# Altium schematic sheet supply1.SchDoc: foxBMS BMS-Master
size A3; DocumentNumber: 3; SheetNumber: 3; SheetTotal: 24; Author: Fraunhofer IISB foxBMS Team; REL-DATE: 2017-05-16; VERSION: 1.0.2; SheetDescription: Supply for MCU1 and peripherals
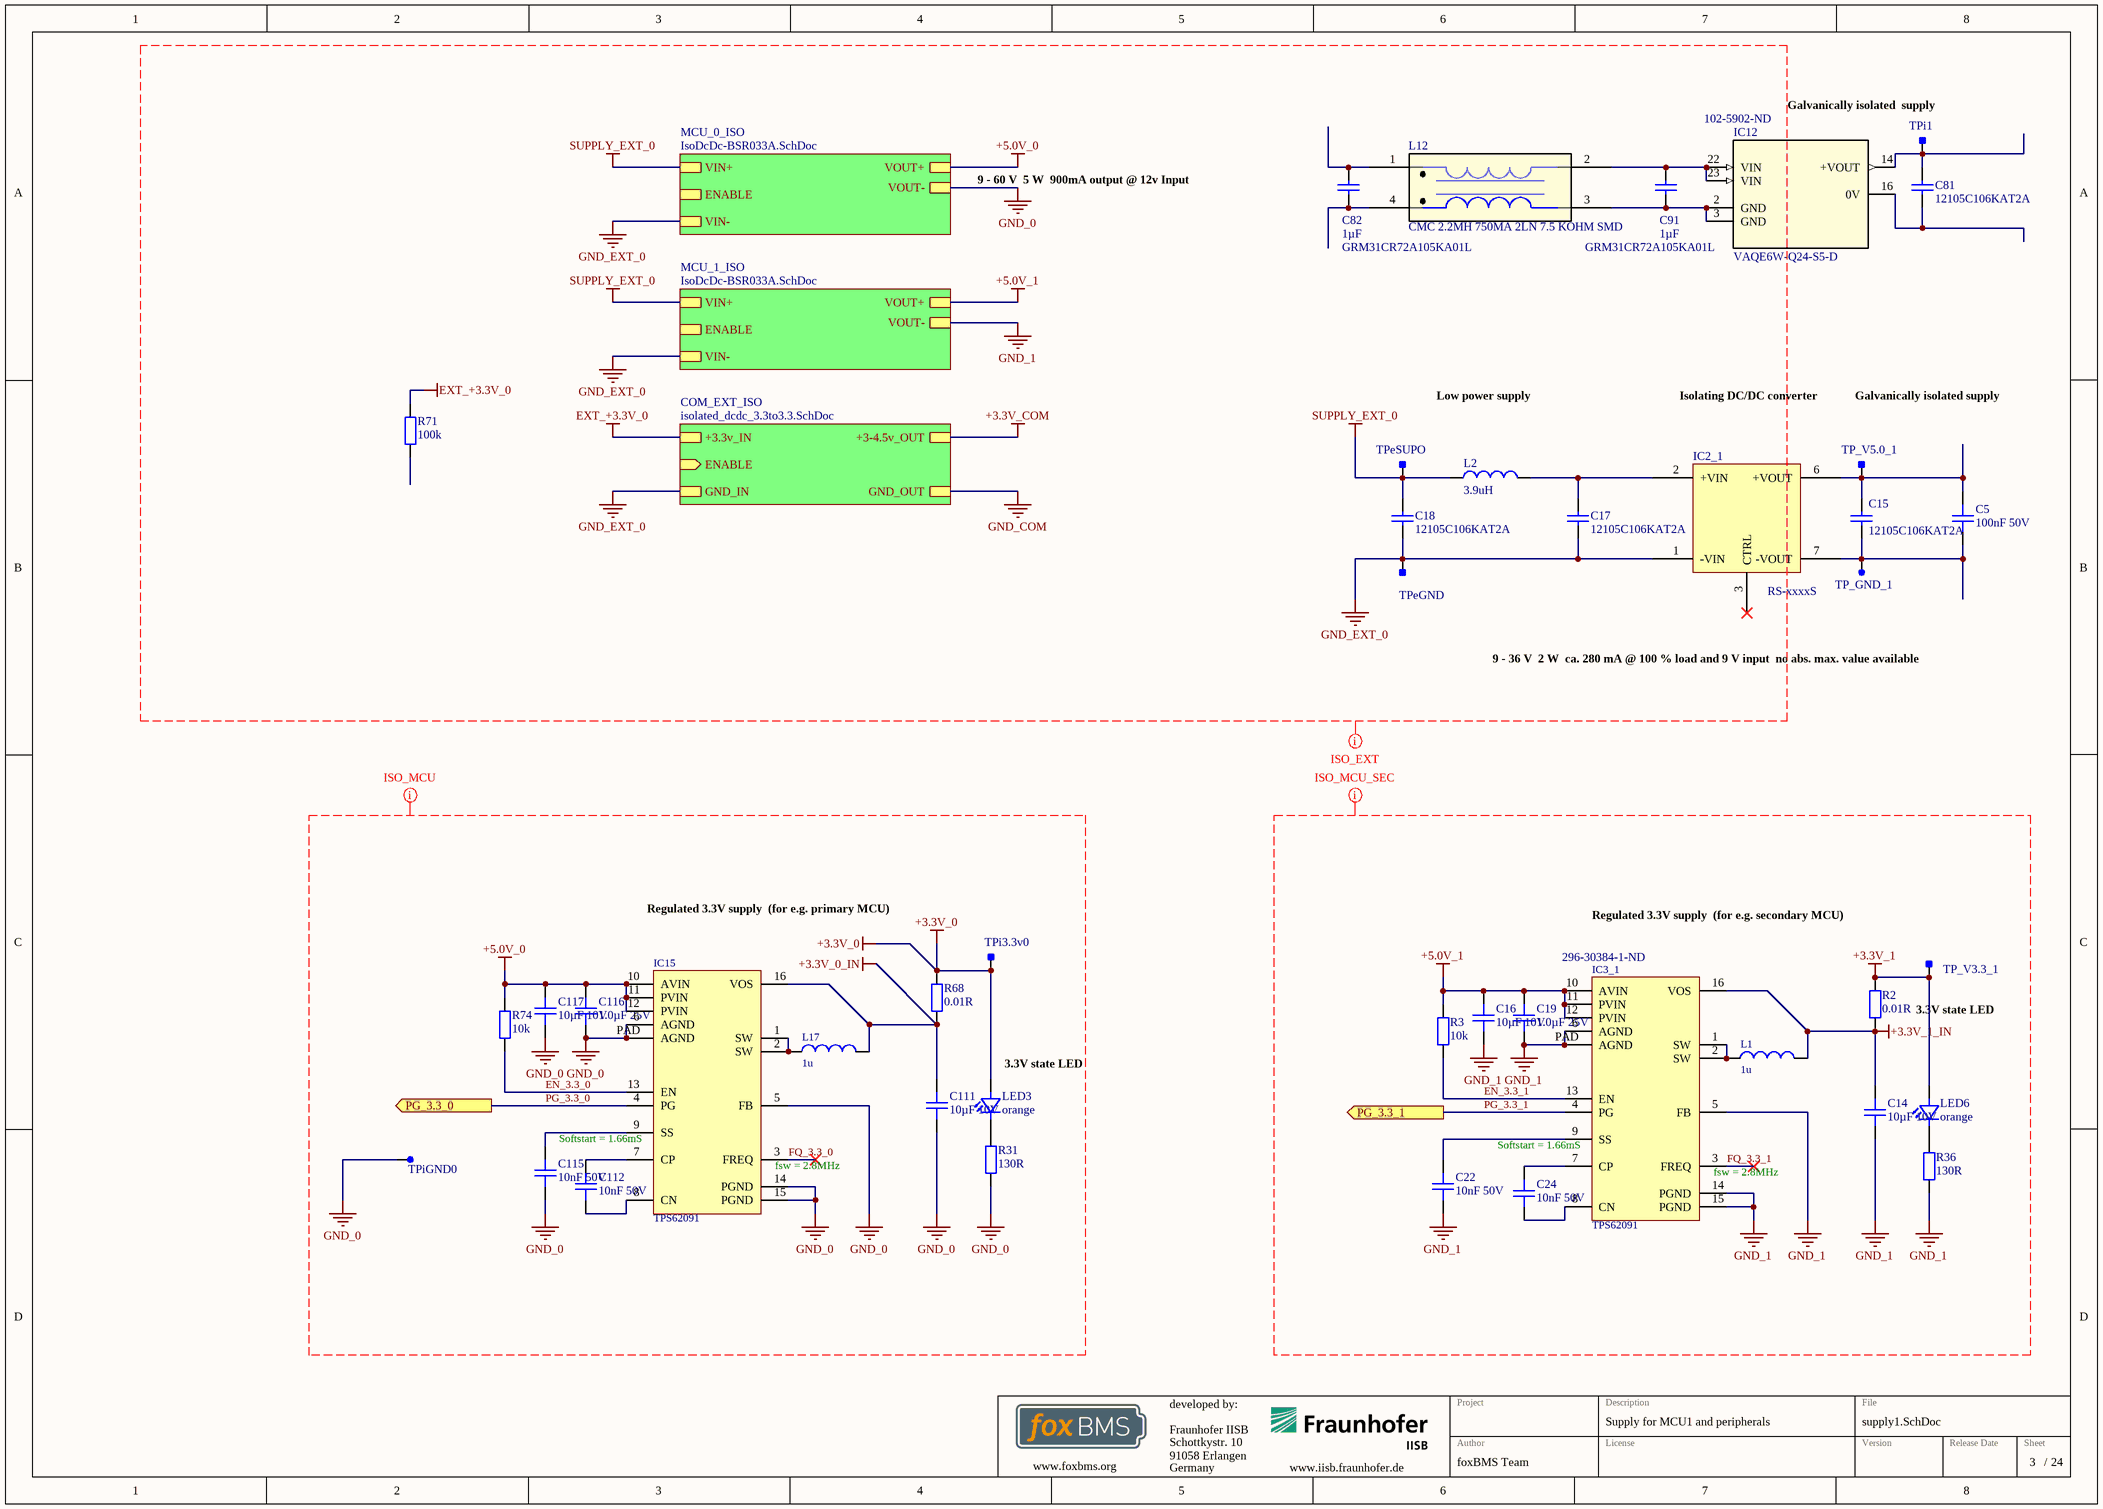
[diagram p0: supply1.SchDoc]

## Parts
C5  100nF 50V  [0603C]
C14  10µF 10V  [0805C]
C15  12105C106KAT2A  [CAPC3225X279X50LL20T25]
C16  10µF 10V  [0805C]
C17  12105C106KAT2A  [CAPC3225X279X50LL20T25]
C18  12105C106KAT2A  [CAPC3225X279X50LL20T25]
C19  1.0µF 25V  [0603C]
C22  10nF 50V  [0603C]
C24  10nF 50V  [0603C]
C81  12105C106KAT2A  [CAPC3225X279X50LL20T25]
C82  GRM31CR72A105KA01L  Capacitance: 1µF  [CAPC3216X180X55ML20T25]
C91  GRM31CR72A105KA01L  Capacitance: 1µF  [CAPC3216X180X55ML20T25]
C111  10µF 10V  [0805C]
C112  10nF 50V  [0603C]
C115  10nF 50V  [0603C]
C116  1.0µF 25V  [0603C]
C117  10µF 10V  [0805C]
IC2_1  RS-xxxxS  [RECOM_RS-S_D]
IC3_1  TPS62091  Supplier Part Number 1: 296-30384-1-ND  [QFN-16-TI]
IC12  VAQE6W-Q24-S5-D  Supplier Part Number 1: 102-5902-ND  [VAQE6W-Q24-S5-D]
IC15  TPS62091  [QFN-16-TI]
L1  1u  [WE-LQS]
L2  value 3.9uH  [INDC4532]  (hidden comment: FIXED IND 3.9UH 1.32A 140MOHM SM)
L12  CMC 2.2MH 750MA 2LN 7.5 KOHM SMD  [WE-SL5]
L17  1u  [WE-LQS]
LED3  orange  [LEDC1608X07N]
LED6  orange  [LEDC1608X07N]
R2  0.01R  [0805R]
R3  10k  [0603R]
R31  130R  [0603R]
R36  130R  [0603R]
R68  0.01R  [0805R]
R71  100k  [0603R]
R74  10k  [0603R]
TP_GND_1  Testpoint_Round  [Testpoint_D1V]  (value not drawn)  (no BOM)
TP_V3.3_1  Testpoint_Square  [Testpoint_S1]  (value not drawn)  (no BOM)
TP_V5.0_1  Testpoint_Square  [Testpoint_S1]  (value not drawn)  (no BOM)
TPeGND  Testpoint_Square  [Testpoint_S1]  (value not drawn)  (no BOM)
TPeSUPO  Testpoint_Square  [Testpoint_S1]  (value not drawn)  (no BOM)
TPi1  Testpoint_Square  [Testpoint_S1]  (value not drawn)  (no BOM)
TPi3.3v0  Testpoint_Square  [Testpoint_S1]  (value not drawn)  (no BOM)
TPiGND0  Testpoint_Round  [Testpoint_D1V]  (value not drawn)  (no BOM)

## Sub-sheets
COM_EXT_ISO = isolated_dcdc_3.3to3.3.SchDoc: ENABLE (in), +3.3v_IN, GND_OUT, +3-4.5v_OUT, GND_IN
MCU_0_ISO = IsoDcDc-BSR033A.SchDoc: ENABLE, VIN+, VOUT+, VOUT-, VIN-
MCU_1_ISO = IsoDcDc-BSR033A.SchDoc: ENABLE, VIN+, VOUT+, VOUT-, VIN-

## Ports
PG_3.3_0 (out), PG_3.3_1 (out)

## Nets
+3.3V_0: LED3.2(A) R68.1 TPi3.3v0.1
+3.3V_0_IN: C111.1 IC15.16(VOS) L17.2 R68.2
+3.3V_1: LED6.2(A) R2.1 TP_V3.3_1.1
+3.3V_1_IN: C14.1 IC3_1.16(VOS) L1.2 R2.2
+3.3V_COM: sheet COM_EXT_ISO/+3-4.5v_OUT
+5.0V_0: C116.1 C117.1 IC15.10(AVIN) IC15.11(PVIN) IC15.12(PVIN) R74.2 ; sheet MCU_0_ISO/VOUT+
+5.0V_1: C16.1 C19.1 IC3_1.10(AVIN) IC3_1.11(PVIN) IC3_1.12(PVIN) R3.2 ; sheet MCU_1_ISO/VOUT+
EXT_+3.3V_0: R71.2 ; sheet COM_EXT_ISO/+3.3v_IN
GND_0: C111.2 C115.2 C116.2 C117.2 IC15.5(FB) IC15.6(AGND) IC15.14(PGND) IC15.15(PGND) IC15.PAD(AGND) R31.1 TPiGND0.1 ; sheet MCU_0_ISO/VOUT-
GND_1: C14.2 C16.2 C19.2 C22.2 IC3_1.5(FB) IC3_1.6(AGND) IC3_1.14(PGND) IC3_1.15(PGND) IC3_1.PAD(AGND) R36.2 ; sheet MCU_1_ISO/VOUT-
GND_COM: sheet COM_EXT_ISO/GND_OUT
GND_EXT_0: C17.1 C18.1 IC2_1.1(-VIN) TPeGND.1 ; sheet MCU_0_ISO/VIN-, sheet MCU_1_ISO/VIN-, sheet COM_EXT_ISO/GND_IN
SUPPLY_EXT_0: C18.2 L2.1 TPeSUPO.1 ; sheet MCU_0_ISO/VIN+, sheet MCU_1_ISO/VIN+
EN_3.3_0: IC15.13(EN) R74.1
EN_3.3_1: IC3_1.13(EN) R3.1
FQ_3.3_0: IC15.3(FREQ)
FQ_3.3_1: IC3_1.3(FREQ)
PG_3.3_0: IC15.4(PG) ; port PG_3.3_0
PG_3.3_1: IC3_1.4(PG) ; port PG_3.3_1
NetC5_1: C5.1 C15.2 IC2_1.6(+VOUT) TP_V5.0_1.1
NetC5_2: C5.2 C15.1 IC2_1.7(-VOUT) TP_GND_1.1
NetC17_2: C17.2 IC2_1.2(+VIN) L2.2
NetC22_1: C22.1 IC3_1.9(SS)
NetC24_1: C24.1 IC3_1.7(CP)
NetC24_2: C24.2 IC3_1.8(CN)
NetC81_1: C81.1 IC12.16(0V)
NetC81_2: C81.2 IC12.14(+VOUT) TPi1.1
NetC82_1: C82.1 L12.4
NetC82_2: C82.2 L12.1
NetC91_1: C91.1 IC12.2(GND) IC12.3(GND) L12.3
NetC91_2: C91.2 IC12.22(VIN) IC12.23(VIN) L12.2
NetC112_1: C112.1 IC15.7(CP)
NetC112_2: C112.2 IC15.8(CN)
NetC115_1: C115.1 IC15.9(SS)
NetIC3_1_1: IC3_1.1(SW) IC3_1.2(SW) L1.1
NetIC15_1: IC15.1(SW) IC15.2(SW) L17.1
NetLED3_1: LED3.1(C) R31.2
NetLED6_1: LED6.1(C) R36.1

Not connected (* = marked no-connect by the designer): IC2_1 3(CTRL)*; R71 1

## Layout directives
net class ISO_MCU_SEC: +3.3V_1, +3.3V_1_IN, +5.0V_1, EN_3.3_1, FQ_3.3_1, GND_1, PG_3.3_1
net class ISO_EXT: +3.3V_COM, +5.0V_0, +5.0V_1, EXT_+3.3V_0, GND_0, GND_1, GND_COM, GND_EXT_0, SUPPLY_EXT_0
net class ISO_MCU: +3.3V_0, +3.3V_0_IN, +5.0V_0, EN_3.3_0, FQ_3.3_0, GND_0, PG_3.3_0

## Notes on the sheet
- (near TPi1) Galvanically isolated
  supply
- 9 - 60 V
  5 W
  900mA output @ 12v Input
- Low power supply
- Isolating DC/DC converter
- Galvanically isolated supply
- 9 - 36 V
  2 W
  ca. 280 mA @ 100 % load and 9 V input
  no abs. max. value available
- Regulated 3.3V supply
  (for e.g. primary MCU)
- Regulated 3.3V supply
  (for e.g. secondary MCU)
- 3.3V state LED
- (near LED3) 3.3V state LED
- (near IC15) Softstart = 1.66mS
- (near IC15) fsw = 2.8MHz
- (near IC3_1) Softstart = 1.66mS
- (near IC3_1) fsw = 2.8MHz
- Fraunhofer IISB
- Schottkystr. 10
- developed by:
- 91058 Erlangen
- Germany
- Author
- Project
- License
- Description
- File
- Version
- Release Date
- Sheet
- www.foxbms.org
- www.iisb.fraunhofer.de
- foxBMS Team
- /

## Library data of the parts
C5 = gen_C_ceramic_100n_50V_X7R_0603: Ceramic, 100nF, ±10%, 50V, X7R, –55 to 125°C, 0603 (1608),RoHS, Automotive; Part Number: GCJ188R71H104KA12; Manufacturer: Murata; Capacitance: 100n; Case EIA: 0603; Case Metric: 1608; PnP Package: C_0603_10; PnP Value: 100nF/50V/X7R; PnP equipped: x; Automotive Qualified: True; Rated Voltage: 50V; Dielectric: X7R; Supplier 1: Digi-Key; Supplier Part Number 1: 490-5798-1-ND; Height - Seated (Max): 0.8mm; Mounting Type: SurfaceMount,MLCC; Operating Temperature: –55 to 125°C; Series: GCJ; Tolerance: ±10%; Manufacturer_Part_Number: GCJ188R71H104KA12
C14 C16 C111 C117 = gen_C_ceramic_10u_10V_X7R_0805: Ceramic, 10µF, ±10%, 10V, X7R, –55 to 125°C, 0805 (2012),RoHS, Automotive; Part Number: GCJ21BR71A106KE01; Manufacturer: Murata; Case EIA: 0805; Case Metric: 2012; Automotive Qualified: True; PnP Package: C_0805_10; PnP Value: 10µF/10V/X7R; Dielectric: X7R; Capacitance: 10µF; Height - Seated (Max): 1.25mm; Mounting Type: SurfaceMount,MLCC; Operating Temperature: –55 to 125°C; Rated Voltage: 10V; Series: GCJ; Tolerance: ±10%; Manufacturer_Part_Number: GCJ21BR71A106KE01; Supplier 1: Digi-Key; Supplier Part Number 1: 490-12646-1-ND
C15 C17 C18 C81 = gen_C_ceramic_10u_25V_X7R_1210: Multilayer Ceramic Capacitor, 50 V, -55 to 125 degC, 2-Pin SMD (1210), RoHS, Tape and Reel; Manufacturer: AVX; Dielectric: X7R; Tolerance: 10%; Capacitance: 10uF; Load Life: 1000h; Type: CommercialSurfaceMountChip; Voltage Rating: 50V; Temperature Coefficient / Code: +/-15%; Automotive Qualified: True; Case EIA: 1210; Case Metric: 3225; PnP Package: C_1210_10; PnP Value: 10µF/25V/X7R; Rated Voltage: 25V; Maximum Operating Temperature: +125C; Mounting Technology: SurfaceMount; Case Code - in: 1210; Package Description: 2-Pin Surface Mount Device, Body 3.2 x 2.5 mm; Datasheet URL: http://www.farnell.com/datasheets/1818074.pdf; Case Code - mm: 3225; Package / Case: 1210(3225metric); Product: GeneralTypeMLCCs; Product Category: MultilayerCeramicCapacitorsMLCC-SMD/SMT; Minimum Operating Temperature: -55C; Manufacturer URL: http://www.avx.com/; Operating Temperature Range: -55Cto+125C; Termination Style: SMD/SMT; Factory Pack Quantity: 1000; RoHS: Details; Brand: AVX; Datasheet Version: 03/2014; Package Reference: 1210; Packaging: Reel; Voltage Rating DC: 50V; Operating Temperature: –55 to 125°C
C19 C116 = gen_C_ceramic_1u_25V_X7R_0603: Ceramic, 1.0µF, ±10%, 25V, X7R, –55 to 125°C, 0603 (1608),RoHS, Automotive; Part Number: GCJ188R71E105KA01; Manufacturer: Murata; Case EIA: 0603; Case Metric: 1608; Capacitance: 1µF; Automotive Qualified: True; PnP Package: C_0603_10; PnP Value: 1.0µF/25V/X7R; Dielectric: X7R; Rated Voltage: 25V; Height - Seated (Max): 0.8mm; Mounting Type: SurfaceMount,MLCC; Operating Temperature: –55 to 125°C; Series: GCJ; Tolerance: ±10%; Manufacturer_Part_Number: GCJ188R71E105KA01; Supplier 1: Digi-Key; Supplier Part Number 1: 490-14409-1-ND
C22 C24 C112 C115 = gen_C_ceramic_10n_50V_X7R_0603: Ceramic, 10nF, ±10%, 50V, X7R, –55 to 125°C, 0603 (1608),RoHS, Automotive; Part Number: GCJ188R71H102KA01; Manufacturer: Murata; Case EIA: 0603; Case Metric: 1608; Capacitance: 10n; Automotive Qualified: True; PnP Package: C_0603_10; PnP Value: 10nF/50V/X7R; Dielectric: X7R; Rated Voltage: 50V; Height - Seated (Max): 0.8mm; Mounting Type: SurfaceMount,MLCC; Operating Temperature: –55 to 125°C; Series: GCJ; Tolerance: ±10%; Manufacturer_Part_Number: GCJ188R71H102KA01; Supplier 1: Digi-Key; Supplier Part Number 1: 490-5768-1-ND
C82 C91 = gen_C_ceramic_1u_100V_X7R_1206: Chip Capacitor, 1 uF, +/- 10%, 100 V, -55 to 125 degC, 1206 (3216 Metric), RoHS, Tape and Reel; Manufacturer: Murata; Catalog Drawings: GRMSeries_1206_1.6; Featured Product: GA3SafetyRecognizedCapsandHi-CapMLCC; Online Catalog: GRMSeries; Temperature Coefficient: X7R; Product Training Modules: High-CapMultilayerCeramicCapacitors; Other Names: 490-3909-6; Voltage - Rated: 100V; Case EIA: 1206; PnP Package: C_1206_10; PnP Value: 1.0µF/100V/X7R; Height - Seated (Max): -; Features: -; Applications: GeneralPurpose; Manufacturer URL: http://www.murata.com/; Standard Package: 1; Package Reference: 1206; Series: GRM; Package / Case: 1206(3216Metric); Datasheet Version: Sep-11; Ratings: -; Category: Capacitors; Datasheet URL: https://datasheet.ciiva.com/29199/454987-da-01-en-vs-kondensator-1206-29199435.pdf; Operating Temperature: -55degC~125degC; Lead Spacing: -; Family: CeramicCapacitors; Tolerance: ±10%; Packaging: Digi-Reel; Mounting Type: SurfaceMount,MLCC; Package Description: 2-Pin Surface Mount Device, Body 3.2 x 1.6 mm; Lead Style: -; Thickness (Max): 0.071"(1.80mm); Size / Dimension: 0.126"Lx0.063"W(3.20mmx1.60mm); Dielectric: X7R; Rated Voltage: 100V
IC2_1 = Recom_RS-2405SZ/H3: Isolating DC/DC Converter; Manufacturer: Recom; Automotive Qualified: False; Part Number: Recom_RS-2405SZ/H3; ComponentLink1Description: Datasheet; ComponentLink1URL: https://www.recom-power.com/pdf/Econoline/RS-S_D_Z.pdf; Supplier 1: Digikey; Supplier Part Number 1: 945-1552-5-ND; Supplier 2: Farnell; Supplier Part Number 2: 1893731; Supplier 3: Mouser; Supplier Part Number 3: 919-RS-2405SZ/H3
IC3_1 IC15 = TPS62090: '''TI TPS62091 Integrated Sync. Buck Converter''' / - fsw=1.4/2.8MHz / - Vin = 2.5-6V, Vout=3.3V, Iout=3A / - 3x3mm QFN-16, RoHS compliant; DBDesc: '''TI TPS62091 Integrated Sync. Buck Converter''' / - fsw=1.4/2.8MHz / - Vin = 2.5-6V, Vout=0.8-Vin, Iout=3A / - 3x3mm QFN-16, RoHS compliant; ID: 21555; Part Number: TPS62091; Supplier 1: Digi-Key
  IC15: Supplier Part Number 1: 296-30384-1-ND
IC12 = VAQE6W-Q24-S5-D: DC DC CONVERTER 5V 6W; Input: 9-36V; Output: 5V 1.2A; Power: 6W; PartNumber: VAQE6W-Q24-S5-D; Part Number: VAQE6W-Q24-S5-D; Supplier 1: Digi-Key
L1 L17 = ind_1515: 1u 3.8A 25mR 20% IFSC-1515 inductor, RoHS compliant; DBDesc: Wurth 74404042010, 1u 3.2A 27mR 30% inductor, RoHS compliant; ID: 25863; Part Number: IFSC-1515; Supplier 1: Digi-Key; Supplier Part Number 1: 732-5502-1-ND
L2 = Inductor: 3.9µH Unshielded Wirewound Inductor 1.32A 140mOhm Max 1812 (4532 Metric); PartNumber: RLS-397; Code_IEC: 1005; Published: 8-Jun-2000; LatestRevisionDate: 29-May-2009; LatestRevisionNote: IPC-7351 Footprint Added.; PackageReference: 4532; Publisher: Altium Limited; PackageDescription: Chip Inductor; Code_JEITA: 4532; Part Number: INDC-4532
L12 = 744272222: 2.2mH @ 100kHz 2 Line Common Mode Choke Surface Mount 7.5 kOhms @ 4MHz 750mA DCR 300mOhm; Manufacturer: Wurth Electronics Inc.; Vendor: Murata; Built_By: EMA_UL_Team; Type: DEV; Manufacturer_Part_Number: 744272222; Copyright: Copyright (C) 2018 Accelerated Designs. All rights reserved; RefDes: RefDes; Value: Value; SupplierPartNumber: 732-1494-1-ND; Part Number: 744272222
LED3 LED6 = gen_LED_0603_orange: LED; Breakdown Voltage: 5V; Continuous Forward Current: 20mA; Forward Voltage @ 20mA: 2.2V; Automotive Qualified: False; Case EIA: 0603; Case Metric: 1608; Part Number: gen_LED_0603_orange; Color: orange; PnP Package: LED_0603; Supplier 1: Farnell; Supplier Part Number 1: 2099222
R2 R68 = gen_R_0.01R_0805: SMD Resistor 10m 0805; Case EIA: 0805; Case Metric: 2012; PnP Package: R_0603; Operating Temperature: -55°C - +155°C; PnP Value: 0.01R; Part Number: gen_R_0.01R_0805
R3 R74 = gen_R_10k_0603: SMD Resistor 10k 0603; Case EIA: 0603; Case Metric: 1608; PnP Package: R_0603; Automotive Qualified: False; Tolerance: 1%; Power: 0.1W; Maximum Working Voltage: 75V; Part Number: gen_R_10k_0603; PnP Value: 10k; Supplier 1: Farnell; Supplier Part Number 1: 2073349; Operating Temperature: -55°C - +155°C; Resistance: 10k; Series: E24, E96
R31 R36 = gen_R_130R_0603: SMD Resistor 130R 0603; Tolerance: 1%; Power: 0.1W; Case EIA: 0603; Case Metric: 1608; Maximum Working Voltage: 75V; PnP Package: R_0603; Automotive Qualified: False; Part Number: gen_R_130R_0603; Operating Temperature: -55°C - +155°C; Resistance: 130R; Series: E24, E96; PnP Value: 130R; Supplier 1: Farnell; Supplier Part Number 1: 2379959
R71 = gen_R_100k_0603: SMD Resistor 100k 0603; Case EIA: 0603; Case Metric: 1608; PnP Package: R_0603; Automotive Qualified: False; Operating Temperature: -55°C - +155°C; PnP Value: 100k; Part Number: gen_R_100k_0603
TP_GND_1 TPiGND0 = Testpoint_Round_Via: Testpoint, Via, round; Part Number: Testpoint_Round_Via
TP_V3.3_1 TP_V5.0_1 TPeGND TPeSUPO TPi1 TPi3.3v0 = Testpoint_Square: Testpoint, square; Part Number: Testpoint_Square